# EAGLE schematic rgb-led-cc-driver-mk-6.0 (EAGLE 6.5.0)
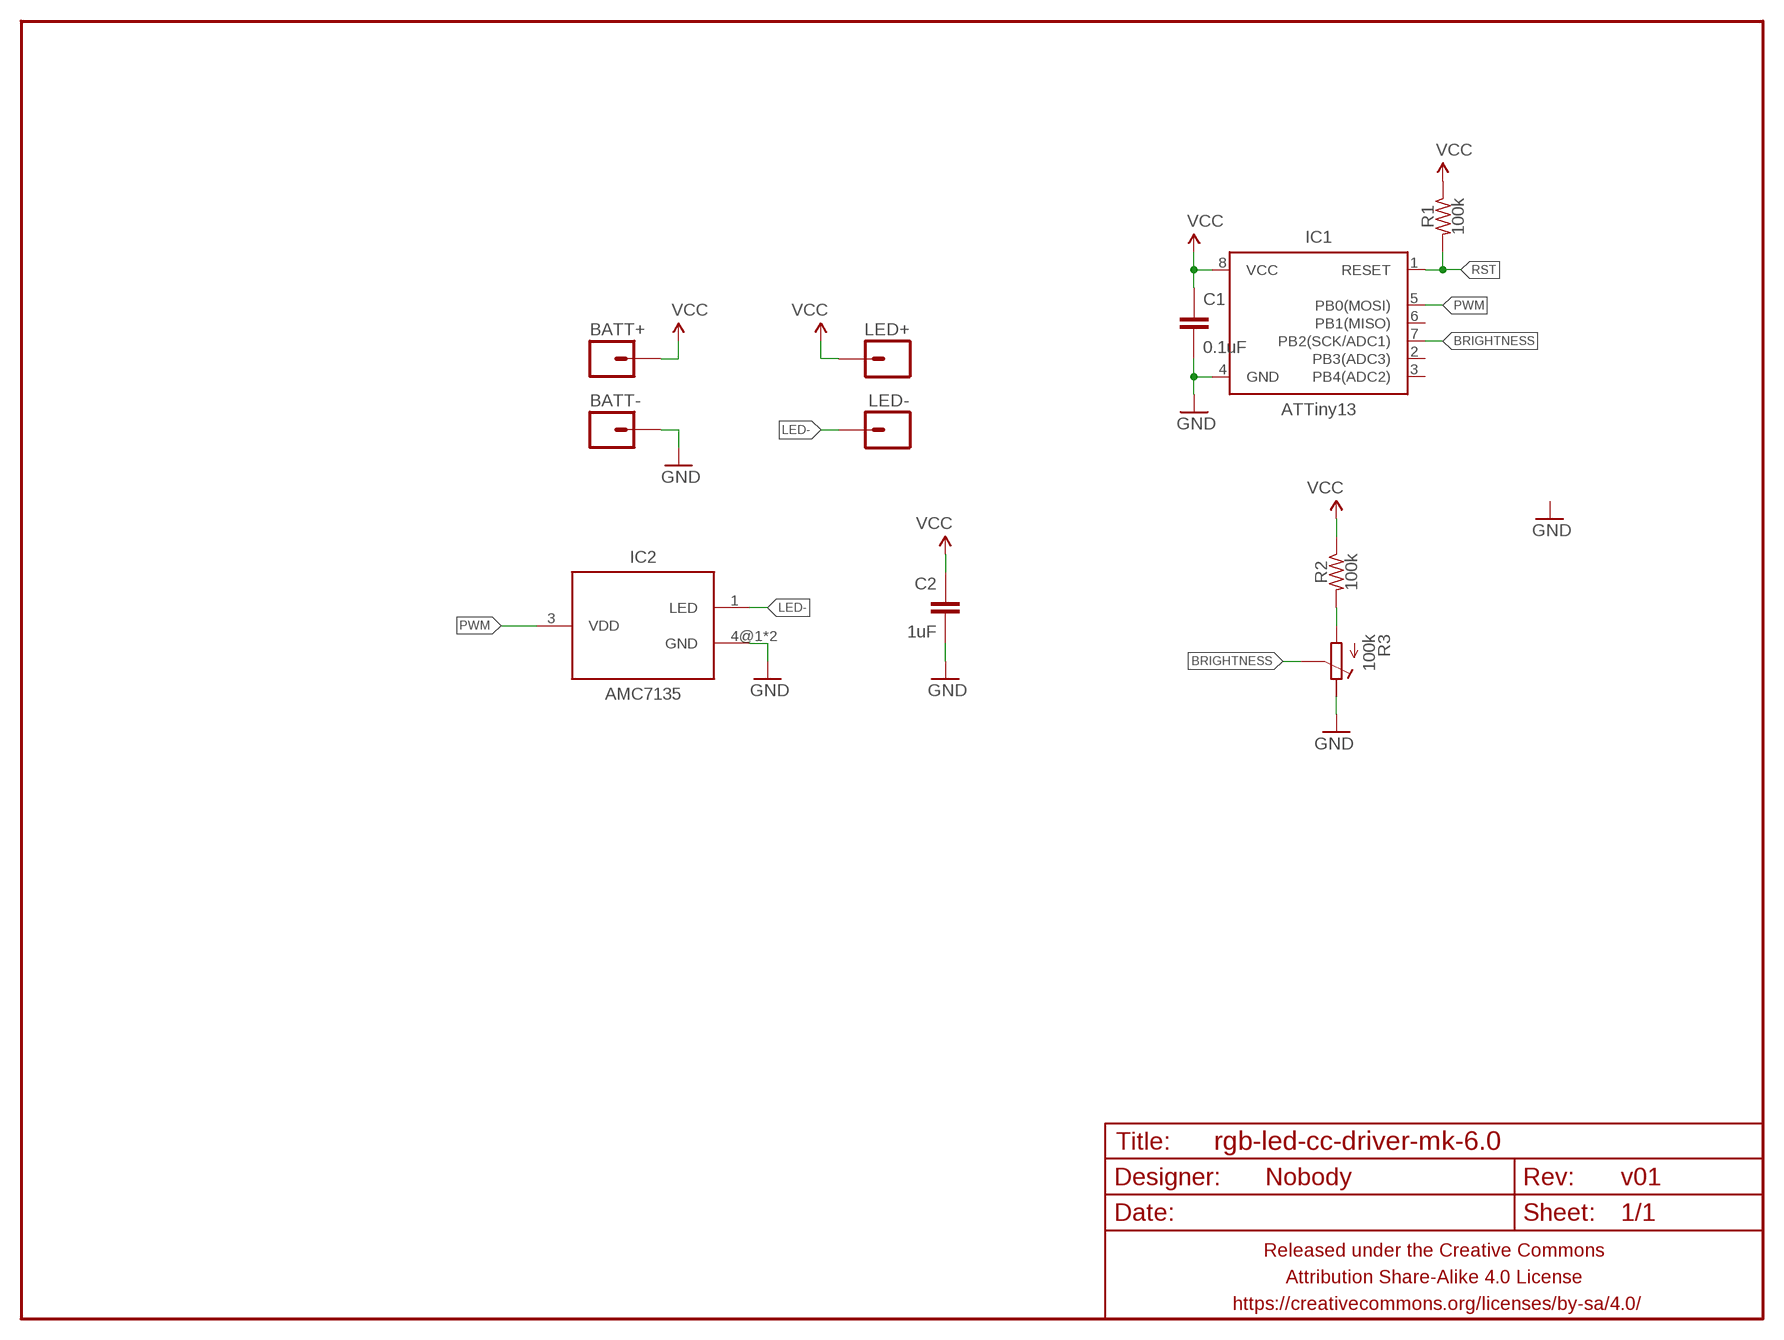
[diagram p0: schematic, sheet 1]

## Parts
BATT+  M01NOT-A-VIA-NOPE  [1X01_NOSILK_NOSTOP]
BATT-  M01NOT-A-VIA-NOPE  [1X01_NOSILK_NOSTOP]
C1  0.1uF  CAPACITOR-CERAMICC0805  [C0805]
C2  1uF  CAPACITOR-CERAMICC1206  [C1206]
FRAME1  FRAME-LETTERNO_PACKAGE  [DUMMY]
IC1  ATTiny13  ATTINY13SOIC  [SO08]
IC2  AMC7135  AMC7135SOT-89-NOTHERM  [SOT89-NOTHERM]
LED+  M01PTH-1.2MM  [1X01-1.2MM]
LED-  M01PTH-1.2MM-NS  [1X01-1.2MM-NS]
R1  100k  RESISTORR0805  [R0805]
R2  100k  RESISTORR0805  [R0805]
R3  100k  POTENTIOMETEREVM3Y  [EVM3Y]

## Nets
BRIGHTNESS: IC1.7(PB2(SCK/ADC1)) R3.S
GND: BATT-.P$1 C1.2 C2.2 IC1.4(GND) IC2.4@1(GND) IC2.4@2(GND) R3.E
LED-: IC2.1(LED) LED-.P$1
N$1: R2.2 R3.A
PWM: IC1.5(PB0(MOSI)) IC2.3(VDD)
RST: IC1.1(RESET) R1.2
VCC: BATT+.P$1 C1.1 C2.1 IC1.8(VCC) LED+.P$1 R1.1 R2.1
Unconnected: IC1.2(PB3(ADC3)) IC1.3(PB4(ADC2)) IC1.6(PB1(MISO))

## Library data of the parts
BATT+ BATT- LED+ LED- = A_butts:M01: Header 1 Standard 1-pin 0.1" header. Use with straight break away headers (SKU : PRT-00116), right angle break away headers (PRT-00553), swiss pins (PRT-00743), machine pins (PRT-00117), and female headers (PRT-00115).
C1 C2 = A_butts:CAPACITOR-CERAMIC: CAPACITOR, European symbol
FRAME1 = A_butts:FRAME-LETTER: Schematic Frame Standard 8.5x11 US Letter frame; DESIGNER: Nobody; VERSION: v01
IC1 = A_butts:ATTINY13: Atmel 8-pin 1kB flash uC
IC2 = A_butts:AMC7135
R1 R2 = A_butts:RESISTOR: RESISTOR, American symbol
R3 = A_butts:POTENTIOMETER: Trimm resistor